# Altium schematic sheet ledring.SchDoc
size A
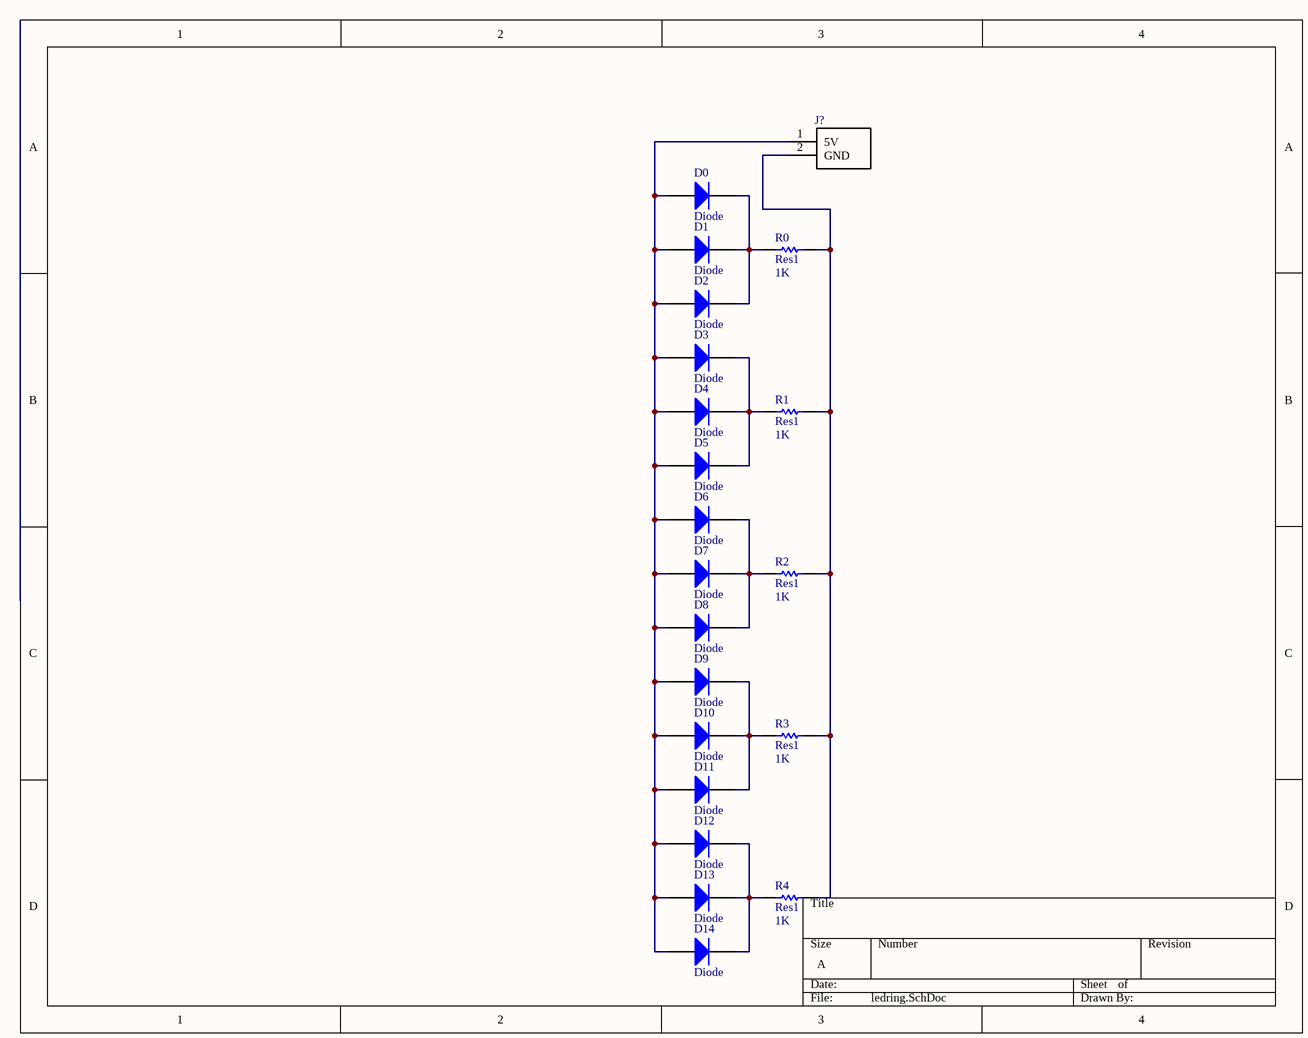
[diagram p0: ledring.SchDoc]

## Parts
D0  Diode  [SMC]
D1  Diode  [SMC]
D2  Diode  [SMC]
D3  Diode  [SMC]
D4  Diode  [SMC]
D5  Diode  [SMC]
D6  Diode  [SMC]
D7  Diode  [SMC]
D8  Diode  [SMC]
D9  Diode  [SMC]
D10  Diode  [SMC]
D11  Diode  [SMC]
D12  Diode  [SMC]
D13  Diode  [SMC]
D14  Diode  [SMC]
J?  282856-2  [*TE_282856-2]  (value not drawn)
R0  Res1  value 1K  [AXIAL-0.3]
R1  Res1  value 1K  [AXIAL-0.3]
R2  Res1  value 1K  [AXIAL-0.3]
R3  Res1  value 1K  [AXIAL-0.3]
R4  Res1  value 1K  [AXIAL-0.3]

## Nets
NetD0_1: D0.1(A) D1.1(A) D2.1(A) D3.1(A) D4.1(A) D5.1(A) D6.1(A) D7.1(A) D8.1(A) D9.1(A) D10.1(A) D11.1(A) D12.1(A) D13.1(A) D14.1(A) J?.1(5V)
NetD0_2: D0.2(K) D1.2(K) D2.2(K) R0.1
NetD3_2: D3.2(K) D4.2(K) D5.2(K) R1.1
NetD6_2: D6.2(K) D7.2(K) D8.2(K) R2.1
NetD9_2: D9.2(K) D10.2(K) D11.2(K) R3.1
NetD12_2: D12.2(K) D13.2(K) D14.2(K) R4.1
NetJ?_2: J?.2(GND) R0.2 R1.2 R2.2 R3.2 R4.2

## Library data of the parts
D0-D14 = Diode: Default Diode; Published: 8-Jun-2000; LatestRevisionDate: 17-Jul-2002; LatestRevisionNote: Re-released for DXP Platform.; PackageVersion: Sep-1996; PackageReference: SMC; Publisher: Altium Limited; PackageDescription: DO-214-AB/SMC; 2 C-Bend Leads; Body 7.9 x 5.9 mm, inc. leads (LxW); Code_JEDEC: DO-214-AB
J? = 282856-2: TERMI-BLOK PCB MOUNT 2P; MF: TE Connectivity; Availability: Unavailable; TE_purchase_URL: https://www.te.com/usa-en/product-282856-2.html?te_bu=Cor&te_type=disp&te_campaign=seda_glo_cor-seda-global-disp-prtnr-fy19-seda-model-bom-cta_sma-317_1&elqCampaignId=32493; Package: None; Price: None; MP: 282856-2; SnapEDA_Link: https://www.snapeda.com/parts/282856-2/TE%20Connectivity%20AMP%20Connectors/view-part/1809079/?ref=snap; EU_RoHS_Compliance: Compliant with Exemptions; Value: *
R0-R4 = Res1: Resistor; Published: 8-Jun-2000; LatestRevisionDate: 17-Jul-2002; LatestRevisionNote: Re-released for DXP Platform.; PackageReference: AXIAL-0.3; Publisher: Altium Limited; PackageDescription: Axial Device, Thru-Hole; 2 Leads; 0.3 in Pin Spacing